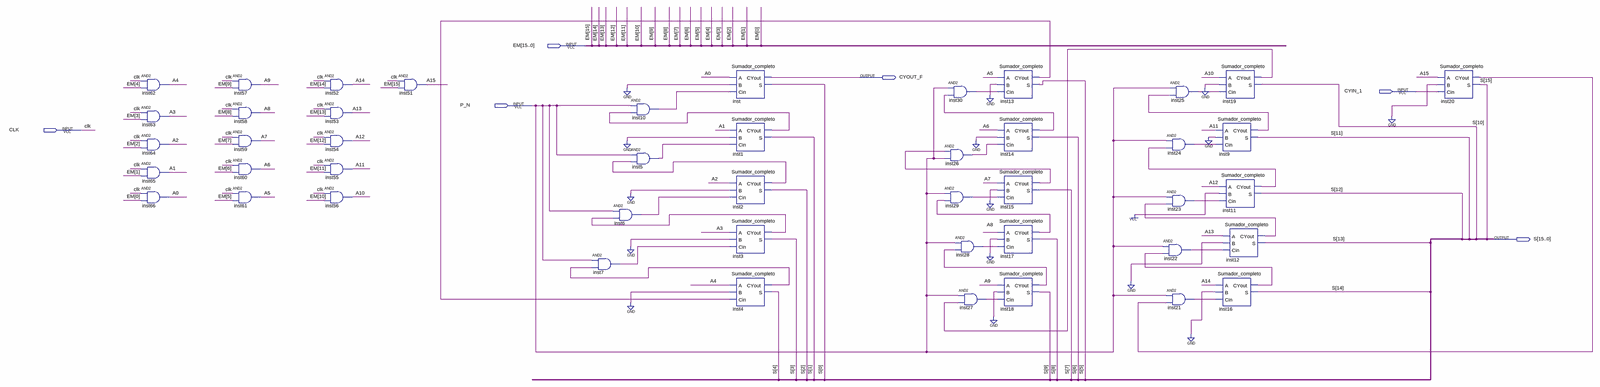
[diagram p0: schematic sheet, whole]
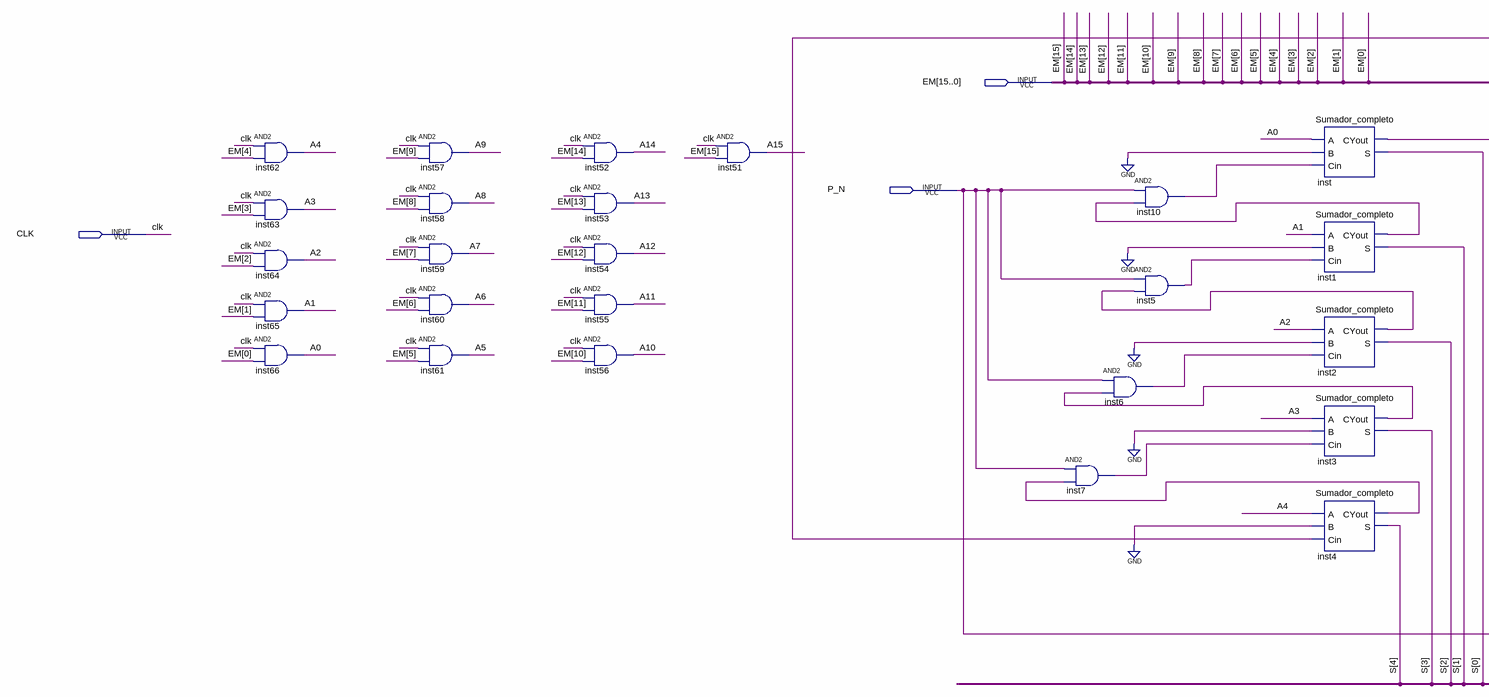
[diagram p1: schematic sheet, left part]
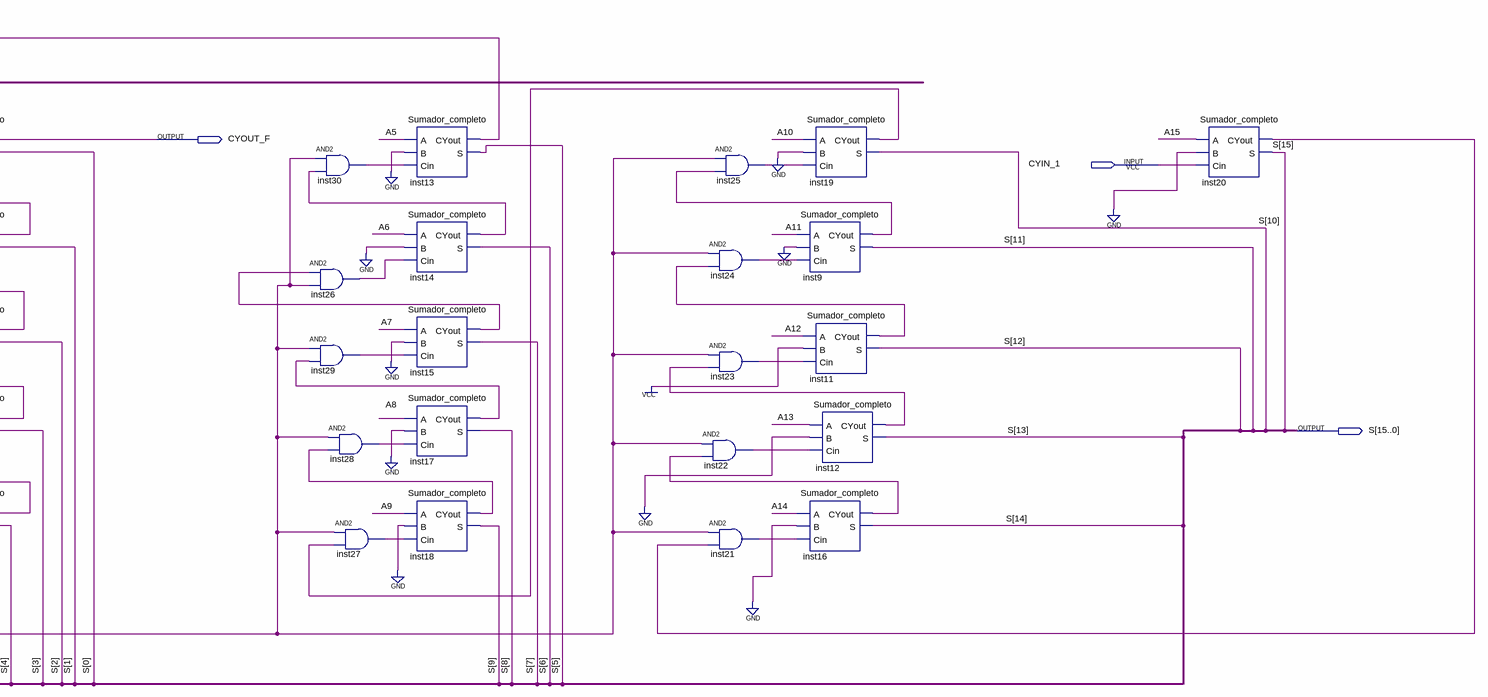
[diagram p2: schematic sheet, right part]
// Quartus schematic Sumador_Completo_5_bits.bdf as structural Verilog: 46 symbols, 6 pins
module Sumador_Completo_5_bits (
  input  [15:0] EM,
  input  CYIN_1,
  input  P_N,
  input  CLK,
  output CYOUT_F,
  output [15:0] S
);

  wire A0, A1, A2, A3, A4, A5, A6, A7, A8, A9, A10, A11, A12, A13, A14, A15, inst1_cyout, inst2_cyout,
       inst3_cyout, inst4_cyout, inst5_out, inst6_out, inst7_out, inst9_cyout, inst10_out, inst11_cyout,
       inst12_cyout, inst13_cyout, inst14_cyout, inst15_cyout, inst16_cyout, inst17_cyout, inst18_cyout,
       inst19_cyout, inst20_cyout, inst21_out, inst22_out, inst23_out, inst24_out, inst25_out, inst26_out,
       inst27_out, inst28_out, inst29_out, inst30_out;

  and inst62 (A4, CLK, EM[4]);
  and inst63 (A3, CLK, EM[3]);
  and inst64 (A2, CLK, EM[2]);
  and inst65 (A1, CLK, EM[1]);
  and inst66 (A0, CLK, EM[0]);
  and inst57 (A9, CLK, EM[9]);
  and inst58 (A8, CLK, EM[8]);
  and inst59 (A7, CLK, EM[7]);
  and inst60 (A6, CLK, EM[6]);
  and inst61 (A5, CLK, EM[5]);
  and inst52 (A14, CLK, EM[14]);
  and inst53 (A13, CLK, EM[13]);
  and inst54 (A12, CLK, EM[12]);
  and inst55 (A11, CLK, EM[11]);
  and inst56 (A10, CLK, EM[10]);
  and inst51 (A15, CLK, EM[15]);
  and inst6 (inst6_out, P_N, inst3_cyout);
  and inst7 (inst7_out, P_N, inst4_cyout);
  and inst10 (inst10_out, P_N, inst1_cyout);
  and inst5 (inst5_out, P_N, inst2_cyout);
  Sumador_completo inst (.A(A0), .B(1'b0), .Cin(inst10_out), .CYout(CYOUT_F), .S(S[0]));
  Sumador_completo inst1 (.A(A1), .B(1'b0), .Cin(inst5_out), .CYout(inst1_cyout), .S(S[1]));
  Sumador_completo inst2 (.A(A2), .B(1'b0), .Cin(inst6_out), .CYout(inst2_cyout), .S(S[2]));
  Sumador_completo inst3 (.A(A3), .B(1'b0), .Cin(inst7_out), .CYout(inst3_cyout), .S(S[3]));
  Sumador_completo inst4 (.A(A4), .B(1'b0), .Cin(inst13_cyout), .CYout(inst4_cyout), .S(S[4]));
  and inst30 (inst30_out, P_N, inst14_cyout);
  and inst26 (inst26_out, inst15_cyout, P_N);
  and inst29 (inst29_out, P_N, inst17_cyout);
  and inst28 (inst28_out, P_N, inst18_cyout);
  and inst27 (inst27_out, P_N, inst19_cyout);
  Sumador_completo inst13 (.A(A5), .B(1'b0), .Cin(inst30_out), .CYout(inst13_cyout), .S(S[5]));
  Sumador_completo inst14 (.A(A6), .B(1'b0), .Cin(inst26_out), .CYout(inst14_cyout), .S(S[6]));
  Sumador_completo inst15 (.A(A7), .B(1'b0), .Cin(inst29_out), .CYout(inst15_cyout), .S(S[7]));
  Sumador_completo inst17 (.A(A8), .B(1'b0), .Cin(inst28_out), .CYout(inst17_cyout), .S(S[8]));
  Sumador_completo inst18 (.A(A9), .B(1'b0), .Cin(inst27_out), .CYout(inst18_cyout), .S(S[9]));
  and inst25 (inst25_out, P_N, inst9_cyout);
  and inst24 (inst24_out, P_N, inst11_cyout);
  and inst23 (inst23_out, P_N, inst12_cyout);
  and inst22 (inst22_out, P_N, inst16_cyout);
  and inst21 (inst21_out, P_N, inst20_cyout);
  Sumador_completo inst19 (.A(A10), .B(1'b0), .Cin(inst25_out), .CYout(inst19_cyout), .S(S[10]));
  Sumador_completo inst9 (.A(A11), .B(1'b0), .Cin(inst24_out), .CYout(inst9_cyout), .S(S[11]));
  Sumador_completo inst11 (.A(A12), .B(1'b1), .Cin(inst23_out), .CYout(inst11_cyout), .S(S[12]));
  Sumador_completo inst12 (.A(A13), .B(1'b0), .Cin(inst22_out), .CYout(inst12_cyout), .S(S[13]));
  Sumador_completo inst16 (.A(A14), .B(1'b0), .Cin(inst21_out), .CYout(inst16_cyout), .S(S[14]));
  Sumador_completo inst20 (.A(A15), .B(1'b0), .Cin(CYIN_1), .CYout(inst20_cyout), .S(S[15]));
endmodule
